# EAGLE design ComparatorsWithVRef_(LT6656) (EAGLE 7.1.0)
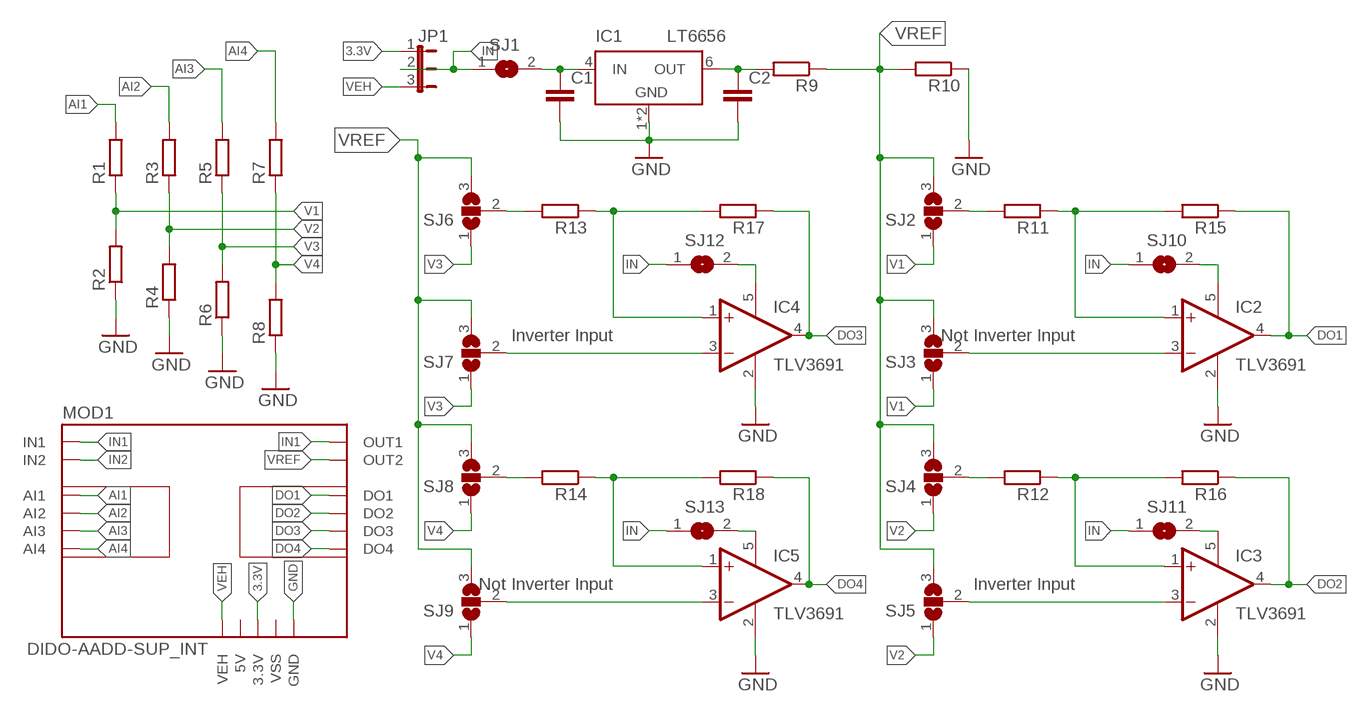
[diagram p0: schematic, sheet 1]

## Parts
C1  0.1u  C-EUC0805  [C0805]
C2  1u  C-EUC0805  [C0805]
IC1  LT6656  [TSOT23-6]
IC2  TLV3691  [DCK]
IC3  TLV3691  [DCK]
IC4  TLV3691  [DCK]
IC5  TLV3691  [DCK]
JP1  JP2E  [JP2]
MOD1  DIDO-AADD-SUP_INT  [DIDO-AADD-SUP]
R1  R-EU_R0805  [R0805]
R2  R-EU_R0805  [R0805]
R3  R-EU_R0805  [R0805]
R4  R-EU_R0805  [R0805]
R5  R-EU_R0805  [R0805]
R6  R-EU_R0805  [R0805]
R7  R-EU_R0805  [R0805]
R8  R-EU_R0805  [R0805]
R9  R-EU_R0805  [R0805]
R10  R-EU_R0805  [R0805]
R11  R-EU_R0805  [R0805]
R12  R-EU_R0805  [R0805]
R13  R-EU_R0805  [R0805]
R14  R-EU_R0805  [R0805]
R15  R-EU_R0805  [R0805]
R16  R-EU_R0805  [R0805]
R17  R-EU_R0805  [R0805]
R18  R-EU_R0805  [R0805]
SJ1  SJ  [SJ]
SJ2  SJ3  [SJ3]
SJ3  SJ3  [SJ3]
SJ4  SJ3  [SJ3]
SJ5  SJ3  [SJ3]
SJ6  SJ3  [SJ3]
SJ7  SJ3  [SJ3]
SJ8  SJ3  [SJ3]
SJ9  SJ3  [SJ3]
SJ10  SJ  [SJ]
SJ11  SJ  [SJ]
SJ12  SJ  [SJ]
SJ13  SJ  [SJ]

## Nets
3.3V: JP1.1 MOD1.3.3V
AI1: MOD1.AI1 R1.2
AI2: MOD1.AI2 R3.2
AI3: MOD1.AI3 R5.2
AI4: MOD1.AI4 R7.2
DO1: IC2.4(OUT) MOD1.DO1 R15.1
DO2: IC3.4(OUT) MOD1.DO2 R16.1
DO3: IC4.4(OUT) MOD1.DO3 R17.1
DO4: IC5.4(OUT) MOD1.DO4 R18.1
GND: C1.2 C2.2 IC1.1(GND) IC1.2(GND) IC2.2(V-) IC3.2(V-) IC4.2(V-) IC5.2(V-) MOD1.GND1(GND) MOD1.GND2(GND) MOD1.GND3(GND) MOD1.GND4(GND) R2.1 R4.1 R6.1 R8.1 R10.1
IN: JP1.2 SJ1.1 SJ10.1 SJ11.1 SJ12.1 SJ13.1
IN1: MOD1.IN1 MOD1.IN2(IN1) MOD1.IN3(IN1) MOD1.IN4(IN1) MOD1.OUT1 MOD1.OUT2(OUT1) MOD1.OUT3(OUT1) MOD1.OUT4(OUT1)
IN2: MOD1.IN2_1(IN2) MOD1.IN2_2(IN2) MOD1.IN2_3(IN2) MOD1.IN2_4(IN2)
N$1: IC3.1(+IN) R12.1 R16.2
N$2: IC2.3(-IN) SJ3.2
N$3: R12.2 SJ4.2
N$4: C2.1 IC1.6(OUT) R9.2
N$8: IC2.1(+IN) R11.1 R15.2
N$9: R11.2 SJ2.2
N$10: IC3.3(-IN) SJ5.2
N$11: R13.2 SJ6.2
N$12: IC4.3(-IN) SJ7.2
N$14: R14.2 SJ8.2
N$15: IC2.5(V+) SJ10.2
N$16: IC4.1(+IN) R13.1 R17.2
N$17: IC5.3(-IN) SJ9.2
N$19: IC5.1(+IN) R14.1 R18.2
N$32: IC5.5(V+) SJ13.2
N$33: IC4.5(V+) SJ12.2
N$34: IC3.5(V+) SJ11.2
N$35: C1.1 IC1.4(IN) SJ1.2
V1: R1.1 R2.2 SJ2.1 SJ3.1
V2: R3.1 R4.2 SJ4.1 SJ5.1
V3: R5.1 R6.2 SJ6.1 SJ7.1
V4: R7.1 R8.2 SJ8.1 SJ9.1
VEH: JP1.3 MOD1.VEH
VREF: MOD1.OUT2_1(OUT2) MOD1.OUT2_2(OUT2) MOD1.OUT2_3(OUT2) MOD1.OUT2_4(OUT2) R9.1 R10.2 SJ2.3 SJ3.3 SJ4.3 SJ5.3 SJ6.3 SJ7.3 SJ8.3 SJ9.3

## Notes on the sheet
- Inverter Input | Not Inverter Input
- Not Inverter Input | Inverter Input

## Power pins joined to a net without a drawn wire
5V: MOD1.5V
VSS: MOD1.VSS

## Library data of the parts
C1 C2 = rcl:C-EU: CAPACITOR, European symbol
IC1 = LT6656:LT6656
IC2-IC5 = TLV3691:TLV3691
JP1 = Jumper_mod:JP2E: JUMPER
MOD1 = AllModules:DIDO-AADD-SUP_INT
R1-R18 = rcl:R-EU_: RESISTOR, European symbol
SJ1 SJ10-SJ13 = Jumper_mod:SJ: SMD solder JUMPER
SJ2-SJ9 = Jumper_mod:SJ3: SMD solder JUMPER

## Board
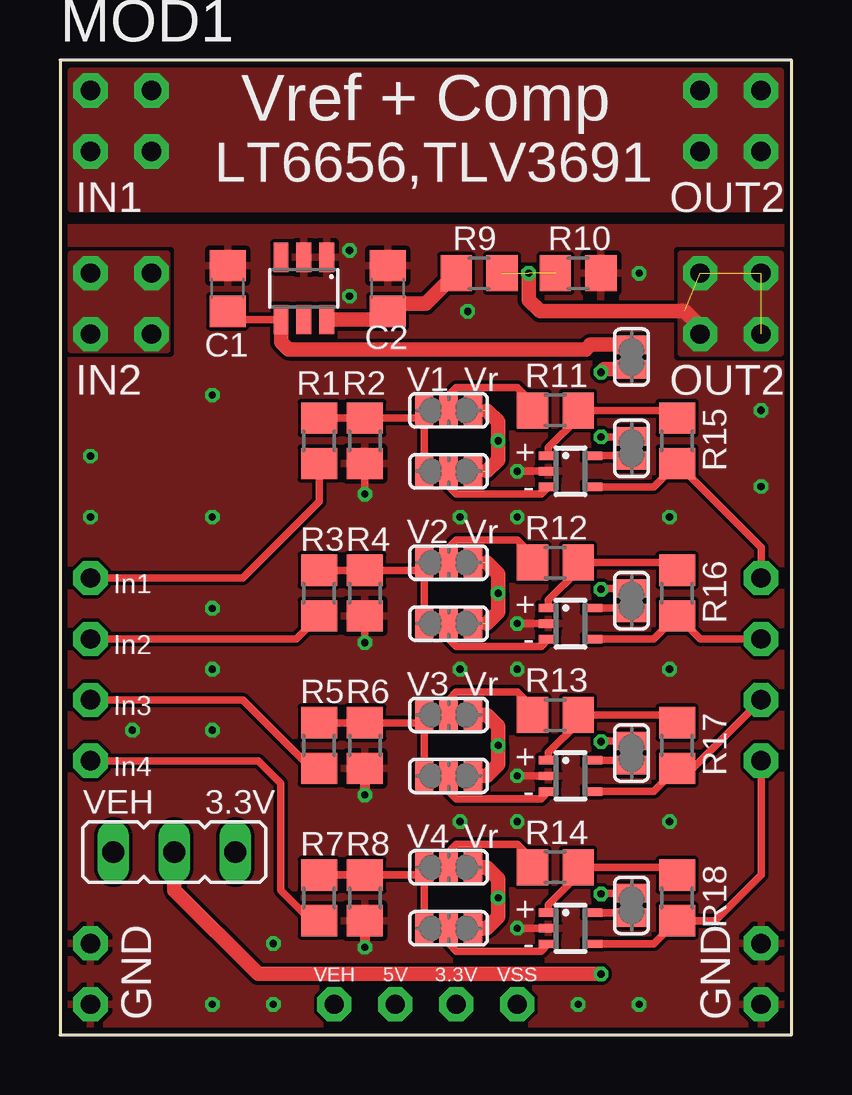
[diagram p1: board, top side]
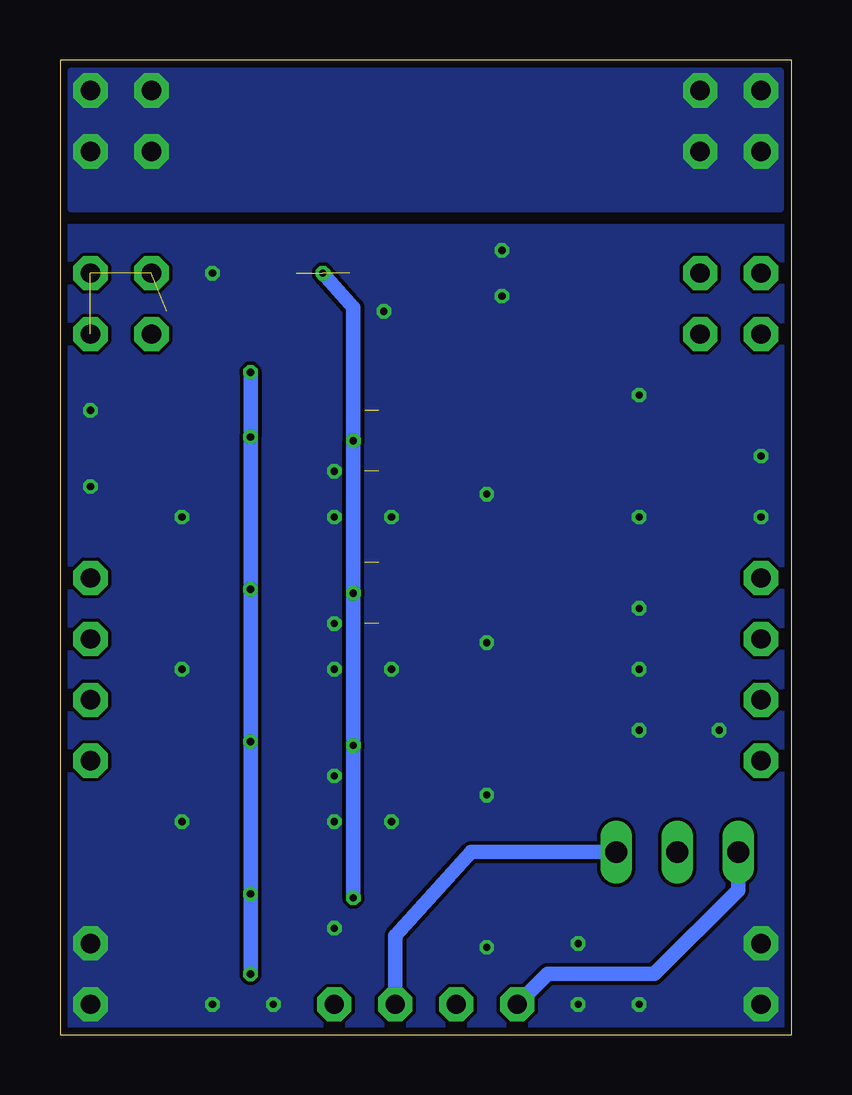
[diagram p2: board, bottom side, seen from below]

Size 30.48 x 40.64 mm. Coordinates in mm from the lower left corner, seen from the top.
Outline: 0,40.64 30.48,40.64 30.48,0 0,0 0,40.64
Copper layers (1*16): Top 0.035mm / dielectric 1.5mm / Bottom 0.035mm
Design rules "PCB-POOL Standard": minimum track width 0.15mm, minimum drill 0.3mm, track to track 0.15mm, track to pad 0.15mm, pad to pad 0.15mm, via to via 0.15mm, smd to smd 0.15mm, copper to edge 0.3mm, drill to drill 0.2mm, minimum pad ring 0.2mm, minimum via ring 0.15mm, stop-mask expansion 0.075mm, vias tented up to drill 0mil, thermal gap 0.2mm

### Footprints (pad centres in the part's own frame; a part is rotated, then mirrored left to right if it is on the bottom)
C0805 = smd 1.3 x 1.5: 1 -0.95,0; 2 0.95,0
TSOT23-6 = smd 0.62 x 1.22: 1 -0.95,-1.3; 2 0,-1.3; 3 0.95,-1.3; 4 0.95,1.3; 5 0,1.3; 6 -0.95,1.3
DCK = smd 0.35 x 0.8: 1 -0.65,-0.925; 2 0,-0.925; 3 0.65,-0.925; 4 0.65,0.925; 5 -0.65,0.925
JP2 = drill 0.914 long: 1 -2.54,0; 2 0,0; 3 2.54,0
DIDO-AADD-SUP = drill 0.8 pad 1.422 octagon: 3.3V 15.24,-38.1; 5V 12.7,-38.1; AI1 0,-20.32; AI2 0,-22.86; AI3 0,-25.4; AI4 0,-27.94; DO1 27.94,-20.32; DO2 27.94,-22.86; DO3 27.94,-25.4; DO4 27.94,-27.94; GND1 0,-38.1; GND2 0,-35.56; GND3 27.94,-35.56; GND4 27.94,-38.1; IN1 0,0; IN2 0,-2.54; IN2_1 0,-7.62; IN2_2 0,-10.16; IN2_3 2.54,-7.62; IN2_4 2.54,-10.16; IN3 2.54,0; IN4 2.54,-2.54; OUT1 25.4,0; OUT2 25.4,-2.54; OUT2_1 25.4,-7.62; OUT2_2 25.4,-10.16; OUT2_3 27.94,-7.62; OUT2_4 27.94,-10.16; OUT3 27.94,0; OUT4 27.94,-2.54; VEH 10.16,-38.1; VSS 17.78,-38.1
R0805 = smd 1.3 x 1.5: 1 -0.95,0; 2 0.95,0
SJ = smd 0.762 x 1.27: 1 -0.508,0; 2 0.508,0
SJ3 = smd 0.762 x 1.27: 1 -1.016,0; 2 0,0; 3 1.016,0

### Placement (x,y rotation side)
C1  6.98,31.11 90 top
C2  13.65,31.11 90 top
IC1  10.16,31.11 180 top
IC2  21.27,23.49 270 top
IC3  21.27,17.14 270 top
IC4  21.27,10.79 270 top
IC5  21.27,4.45 270 top
JP1  4.76,7.62 180 top
MOD1  1.27,39.37 0 top
R1  10.79,24.76 270 top
R2  12.7,24.76 90 top
R3  10.79,18.41 270 top
R4  12.7,18.41 90 top
R5  10.79,12.06 270 top
R6  12.7,12.06 90 top
R7  10.79,5.71 270 top
R8  12.7,5.71 90 top
R9  17.46,31.75 180 top
R10  21.59,31.75 180 top
R11  20.64,26.03 180 top
R12  20.64,19.68 180 top
R13  20.64,13.33 180 top
R14  20.64,6.98 180 top
R15  25.72,24.76 90 top
R16  25.72,18.41 90 top
R17  25.72,12.06 90 top
R18  25.72,5.71 90 top
SJ1  23.81,28.26 90 top
SJ2  16.19,26.03 0 top
SJ3  16.19,23.49 0 top
SJ4  16.19,19.68 0 top
SJ5  16.19,17.14 0 top
SJ6  16.19,13.33 0 top
SJ7  16.19,10.79 0 top
SJ8  16.19,6.98 0 top
SJ9  16.19,4.45 0 top
SJ10  23.81,24.45 270 top
SJ11  23.81,18.1 270 top
SJ12  23.81,11.75 270 top
SJ13  23.81,5.4 270 top

### Tracks (layer width: path | path; a pad name or v marks a point on that pad's centre or on a via)
3.3V
  Bottom 0.61: MOD1.3.3V 16.51,4.13 13.33,7.62 JP1.1
AI1
  Top 0.305: MOD1.AI1 7.62,19.05 10.79,22.22 R1.2
AI2
  Top 0.305: MOD1.AI2 9.84,16.51 R3.2
AI3
  Top 0.305: MOD1.AI3 7.62,13.97 10.47,11.11 R5.2
AI4
  Top 0.305: MOD1.AI4 8.26,11.43 9.21,10.48 9.21,6.03 10.47,4.77 R7.2
DO1
  Top 0.305: IC2.4 24.75,22.84 R15.1 29.21,20.32 MOD1.DO1
DO2
  Top 0.305: IC3.4 24.75,16.49 R16.1 26.67,16.51 MOD1.DO2
DO3
  Top 0.305: IC4.4 24.75,10.14 R17.1 | R17.1 26.04,11.11 | MOD1.DO3 26.36,11.11 R17.1
DO4
  Top 0.305: R18.1 26.04,4.77 | IC5.4 24.75,3.79 R18.1 | R18.1 27.31,4.77 29.21,6.67 MOD1.DO4
GND  (via drill 0.3)
  Top 0.305: v19.05,23.49 IC2.2 | v19.05,4.45 IC5.2 | v19.05,10.79 IC4.2 | v19.05,17.14 IC3.2 | R2.1 v12.7,22.54 | R4.1 v12.7,16.35
  Top 0.406: R6.1 v12.7,10 | R8.1 v12.7,3.65
  other vias: 12.06,32.7 12.06,30.8 6.35,17.78 29.21,26.03 1.27,21.59 6.35,12.7 3.02,12.7 8.89,3.81 16.67,15.24 19.05,15.24 16.67,8.89 19.05,8.89 16.67,21.59 19.05,21.59 16.99,30.16 1.27,24.13 29.21,22.86 24.13,31.75 6.35,15.24 6.35,26.67 8.89,1.27 6.35,1.27 21.59,1.27 24.13,1.27 6.35,21.59 25.4,8.89 25.4,15.24 25.4,21.59
  pour Bottom (rank 2, no thermals): -1.27,33.66 31.75,33.66 31.75,-1.27 -1.27,-1.27
  pour Top (rank 6): -0.64,33.66 31.11,33.66 31.11,-0.64 -0.64,-0.64
IN  (via drill 0.3)
  Top 0.305: v22.54,24.92 23.81,24.92 | v22.54,18.57 22.54,18.6 SJ11.1 | v22.54,12.22 22.54,12.26 SJ12.1 | v22.54,5.87 22.54,5.9 SJ13.1
  Top 0.406: 23.81,24.92 SJ10.1
  Top 0.61: v22.54,2.54 8.26,2.54 4.76,6.03 JP1.2 | v22.54,27.62 22.67,27.75 SJ1.1
  Bottom 0.61: v22.54,2.54 v22.54,5.87 v22.54,12.22 v22.54,18.57 v22.54,24.92 v22.54,27.62
IN1
  pour Bottom (no thermals): 0.48,40.16 30,40.16 30,34.45 0.48,34.45
  pour Top (rank 2, no thermals): 0.48,34.45 0.48,40.16 30,40.16 30,34.45
IN2
  pour Top (no thermals): 0.48,32.38 0.48,28.57 4.45,28.57 4.45,32.54 0.48,32.54
N$1
  Top 0.305: R16.2 25.4,19.68 R12.1 21.59,19.36 20.35,18.12 IC3.1
N$2
  Top 0.305: IC2.3 20.04,22.54 16.51,22.54 16.19,22.86 SJ3.2
N$3
  Top 0.305: SJ4.2 16.19,20.32 16.51,20.64 19.05,20.64 19.69,20 R12.2
N$4
  Top 0.61: IC1.6 12.98,29.81 C2.1 13.65,30.48 15.24,30.48 R9.2
N$8
  Top 0.305: IC2.1 20.35,24.47 21.59,25.71 R11.1 25.4,26.03 R15.2
N$9
  Top 0.305: SJ2.2 16.19,26.67 16.51,26.99 19.05,26.99 19.69,26.35 R11.2
N$10
  Top 0.305: IC3.3 20.04,16.19 16.51,16.19 16.19,16.51 SJ5.2
N$11
  Top 0.305: SJ6.2 16.19,13.97 16.51,14.29 19.05,14.29 19.69,13.65 R13.2
N$12
  Top 0.305: IC4.3 20.04,9.84 16.51,9.84 16.19,10.16 SJ7.2
N$14
  Top 0.305: SJ8.2 16.19,7.62 16.51,7.94 19.05,7.94 19.69,7.3 R14.2
N$15
  Top 0.305: SJ10.2 23.81,24.14 IC2.5
N$16
  Top 0.305: R17.2 25.4,13.33 R13.1 21.59,13.01 20.35,11.77 IC4.1
N$17
  Top 0.305: SJ9.2 16.19,3.81 16.51,3.49 20.04,3.49 IC5.3
N$19
  Top 0.305: R18.2 25.4,6.98 R14.1 21.59,6.66 20.35,5.42 IC5.1
N$32
  Top 0.305: SJ13.2 23.81,5.09 IC5.5
N$33
  Top 0.305: SJ12.2 23.81,11.44 IC4.5
N$34
  Top 0.305: SJ11.2 23.81,17.79 IC3.5
N$35
  Top 0.305: IC1.4 7.34,29.81 C1.1
  Top 0.61: IC1.4 9.21,28.89 9.53,28.57 21.91,28.57 22.1,28.77 SJ1.2
V1
  Top 0.305: SJ3.1 SJ2.1 15.18,25.71 R2.2 R1.1
V2
  Top 0.305: SJ5.1 SJ4.1 15.18,19.36 R4.2 R3.1
V3
  Top 0.305: SJ7.1 SJ6.1 15.18,13.01 R6.2 R5.1
V4
  Top 0.305: SJ9.1 SJ8.1 15.18,6.66 R8.2 R7.1
VEH
  Bottom 0.61: MOD1.VEH 10.16,2.54 5.71,2.54 2.22,6.03 JP1.3
VREF  (via drill 0.3)  (9 unrouted)
  Top 0.61: v19.53,31.75 19.53,30.64 20,30.16 26.04,30.16 26.67,29.53 MOD1.OUT2_2 | 17.78,26.03 18.26,25.56 v18.26,24.76 18.26,23.97 17.78,23.49 | 17.78,19.68 18.26,19.21 v18.26,18.41 18.26,17.62 17.78,17.14 | SJ6.3 17.78,13.33 18.26,12.86 v18.26,12.06 18.26,11.27 17.78,10.79 SJ7.3 | SJ8.3 17.78,6.98 18.26,6.51 v18.26,5.71 18.26,4.92 17.78,4.45 SJ9.3
  Bottom 0.61: v19.53,31.75 18.26,30.32 v18.26,24.76 v18.26,18.41 v18.26,12.06 v18.26,5.71
  pour Top (no thermals): 25.88,32.54 25.88,28.42 30,28.42 30,32.54

### Text on the board
tPlace: In1 | In2 | In3 | In4
tNames: Vref + Comp | LT6656,TLV3691 | V1 | Vr | + | - | V2 | Vr | + | - | V3 | Vr | + | - | VEH | 3.3V | V4 | Vr | + | -
bStop: Beckedahl & Kokert / 14.06.2015